# EAGLE design tx (EAGLE 7.2.0)
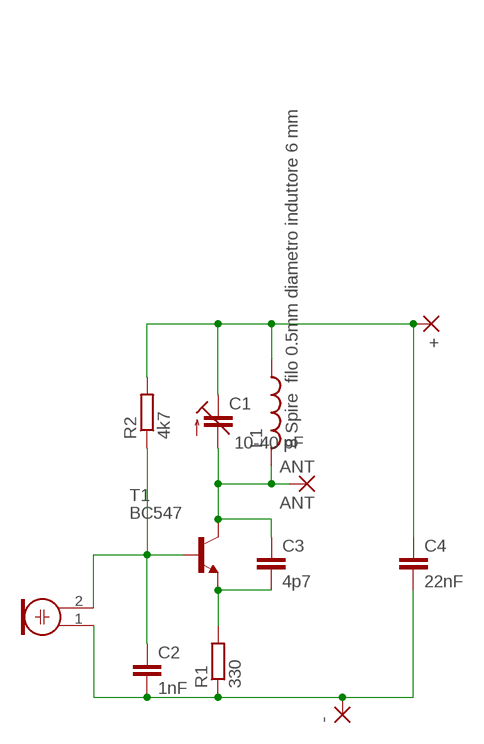
[diagram p0: schematic, sheet 1]

## Parts
+  1,6/0,8  [1,6/0,8]
-  1,6/0,8  [1,6/0,8]
ANT  ANT  1,6/0,8  [1,6/0,8]
C1  10-40 pF  C-TRIMM3008  [3008]
C2  1nF  C-EU025-024X044  [C025-024X044]
C3  4p7  C-EU025-024X044  [C025-024X044]
C4  22nF  C-EU025-024X044  [C025-024X044]
L1  8 Spire filo 0.5mm diametro induttore 6 mm  L-US0207/10  [0207/10]
M1  ELECTRET_MICROPHON-F6050AP  [F6050AP]
R1  330  R-EU_0207/2V  [0207/2V]
R2  4k7  R-EU_0207/2V  [0207/2V]
T1  BC547  [TO92]

## Nets
N$1: +.1(P) C1.+(E) C4.1 L1.1 R2.2
N$2: C2.1 M1.2 R2.1 T1.2(B)
N$3: ANT.1(P) C1.-(A) C3.1 L1.2 T1.3(C)
N$4: -.1(P) C2.2 C4.2 M1.1 R1.1
N$5: C3.2 R1.2 T1.1(E)

## Library data of the parts
+ - ANT = wirepad:1,6/0,8: THROUGH-HOLE PAD
C1 = c-trimm:C-TRIMM: Trimm capacitor; OC_FARNELL: unknown; OC_NEWARK: unknown
C2-C4 = rcl:C-EU: CAPACITOR, European symbol
L1 = rcl:L-US: INDUCTOR, American symbol
M1 = microphon:ELECTRET_MICROPHON-: Electret Condenser Microphone
R1 R2 = rcl:R-EU_: RESISTOR, European symbol
T1 = transistor:BC547: NPN TRANSISTOR

## Board
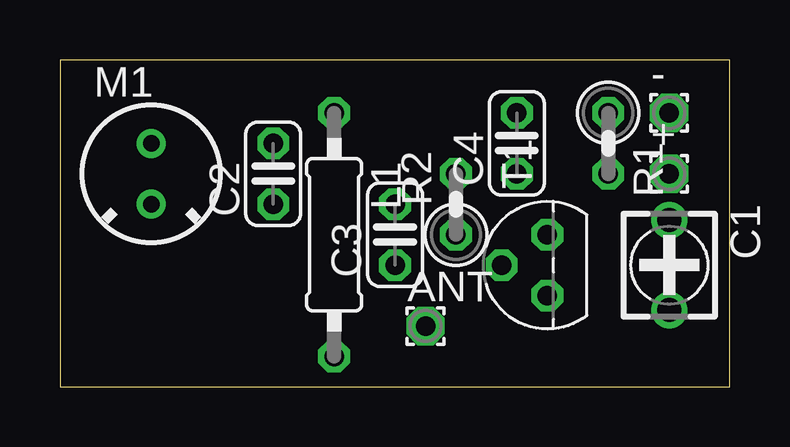
[diagram p1: board, top side]
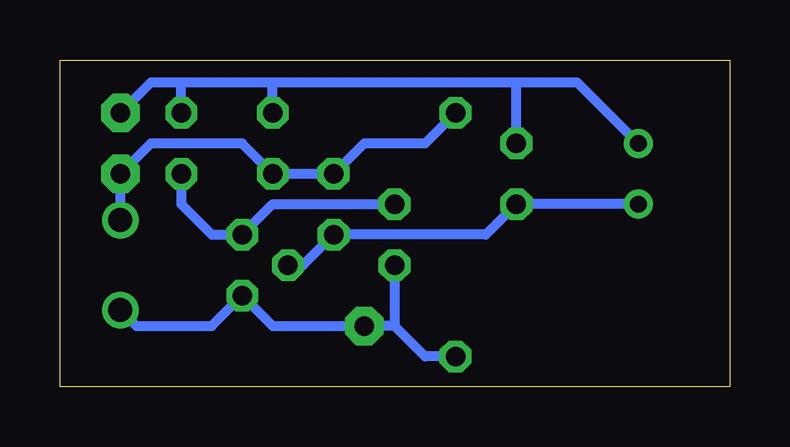
[diagram p2: board, bottom side, seen from below]

Size 27.92 x 13.64 mm. Coordinates in mm from the lower left corner, seen from the top.
Outline: 0,0 27.92,0 27.92,13.64 0,13.64 0,0
Copper layers (1*16): Top 0.035mm / dielectric 1.5mm / Bottom 0.035mm
Design rules "default": minimum track width 10mil, minimum drill 24mil, track to track 8mil, track to pad 8mil, pad to pad 8mil, via to via 8mil, smd to smd 8mil, copper to edge 40mil, drill to drill 8mil, minimum pad ring 10mil, minimum via ring 8mil, stop-mask expansion 4mil, vias tented up to drill 0mil, thermal gap 10mil

### Footprints (pad centres in the part's own frame; a part is rotated, then mirrored left to right if it is on the bottom)
1,6/0,8 = drill 0.813 pad 1.6 octagon: 1 0,0
3008 = drill 1: + -1.875,0; - 1.875,0
C025-024X044 = drill 0.813 octagon: 1 -1.27,0; 2 1.27,0
0207/10 = drill 0.813 octagon: 1 -5.08,0; 2 5.08,0
F6050AP = drill 0.7 pad 1.2: 1 0,1.27; 2 0,-1.27
0207/2V = drill 0.813 octagon: 1 -1.27,0; 2 1.27,0
TO92 = drill 0.813 octagon: 1 1.27,0; 2 0,1.905; 3 -1.27,0

### Placement (x,y rotation side)
+  25.4,8.89 0 top
-  25.4,11.43 0 top
ANT  15.24,2.54 0 top
C1  25.4,5.08 270 top
C2  8.89,8.89 90 top
C3  13.97,6.35 90 top
C4  19.05,10.16 90 top
L1  11.43,6.35 270 top
M1  3.81,8.89 0 top
R1  22.86,10.16 270 top
R2  16.51,7.62 90 top
T1  20.32,5.08 90 top

### Tracks (layer width: path | path; a pad name or v marks a point on that pad's centre or on a via)
N$1
  Bottom 0.406: L1.1 12.7,10.16 15.24,10.16 R2.2 C4.1 20.32,10.16 24.13,10.16 +.1 C1.+
N$2
  Bottom 0.406: M1.2 C2.1 10.16,6.35 R2.1 17.78,5.08 T1.2
N$3
  Bottom 0.406: C1.- 24.73,2.54 21.59,2.54 T1.3 19.05,2.54 ANT.1 13.97,2.54 | L1.2 12.7,1.27 13.97,2.54 | C3.1 13.97,2.54
N$4
  Bottom 0.406: M1.1 6.35,12.7 8.89,12.7 | 8.89,12.7 19.05,12.7 | 19.05,12.7 22.86,12.7 | 22.86,12.7 24.13,12.7 -.1 | R1.1 22.86,12.7 | C4.2 19.05,12.7 | C2.2 8.89,12.7
N$5
  Bottom 0.406: C3.2 19.05,7.62 T1.1 21.59,6.35 22.86,7.62 R1.2